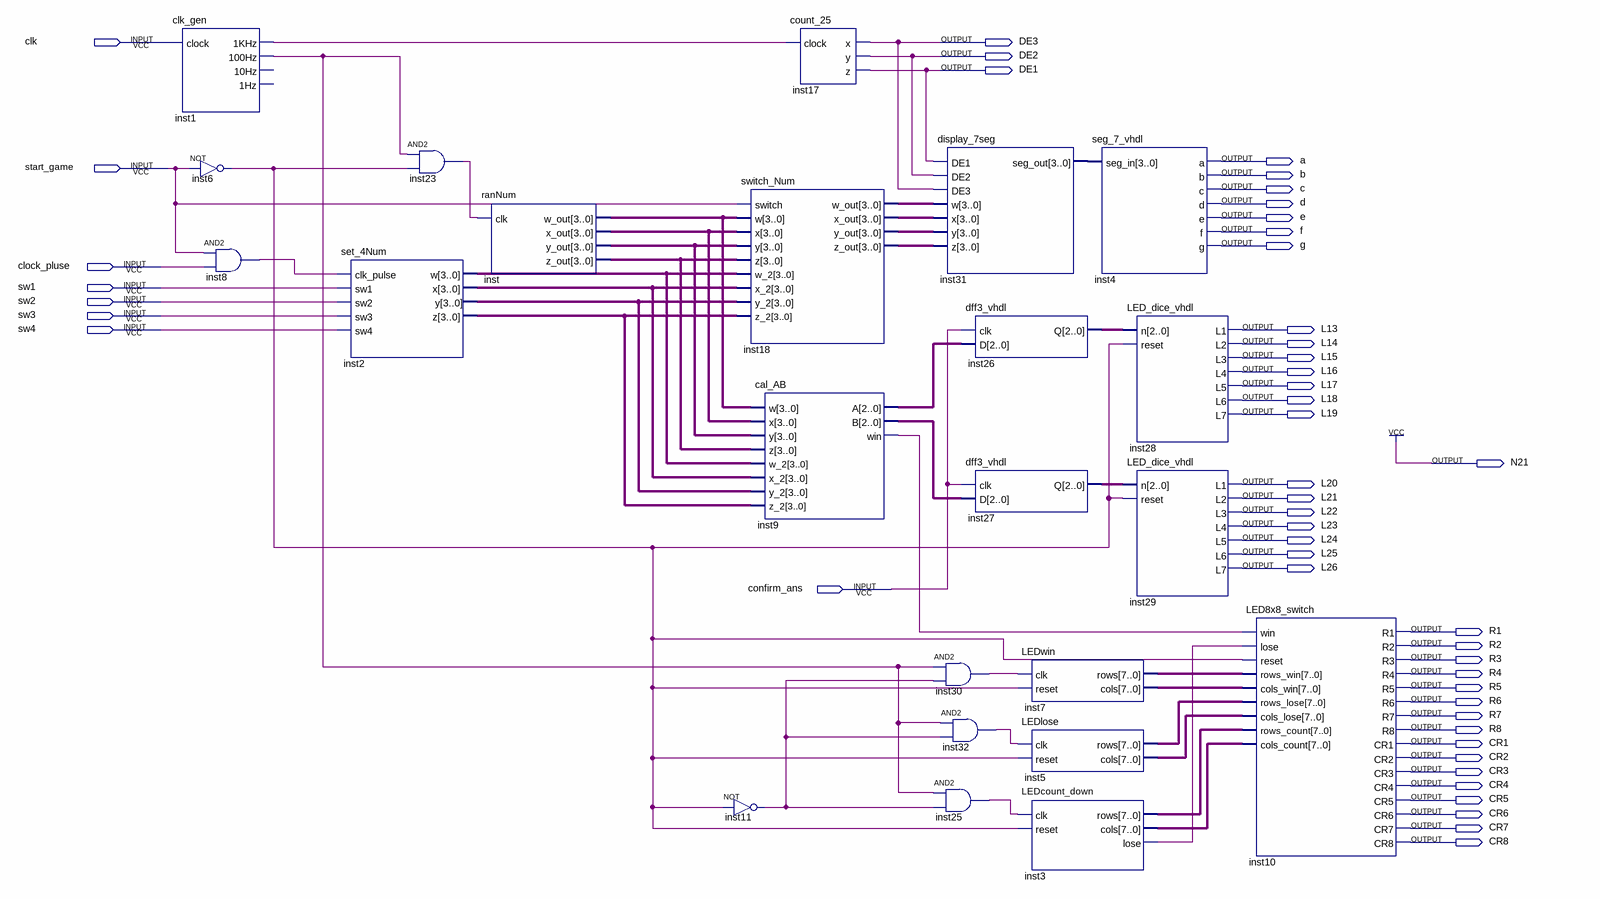
[diagram p0: schematic sheet]
// Quartus schematic Project_ver2.bdf as structural Verilog: 23 symbols, 49 pins
module Project_ver2 (
  input  clk,
  input  start_game,
  input  clock_pluse,
  input  sw1,
  input  sw2,
  input  sw3,
  input  sw4,
  input  confirm_ans,
  output DE3,
  output DE2,
  output DE1,
  output a,
  output b,
  output c,
  output d,
  output e,
  output f,
  output g,
  output L13,
  output L14,
  output L15,
  output L16,
  output L17,
  output L18,
  output L19,
  output N21,
  output L20,
  output L21,
  output L22,
  output L23,
  output L24,
  output L25,
  output L26,
  output R1,
  output R2,
  output R3,
  output R4,
  output R5,
  output R6,
  output R7,
  output R8,
  output CR1,
  output CR2,
  output CR3,
  output CR4,
  output CR5,
  output CR6,
  output CR7,
  output CR8
);

  wire inst1_1khz, inst1_100hz, inst3_lose, inst6_out, inst8_out, inst9_win, inst11_out, inst23_out,
       inst25_out, inst30_out, inst32_out;
  wire [2:0] inst9_a, inst9_b, inst26_q, inst27_q;
  wire [3:0] inst2_w, inst2_x, inst2_y, inst2_z, inst18_w_out, inst18_x_out, inst18_y_out, inst18_z_out,
       inst31_seg_out, inst_w_out, inst_x_out, inst_y_out, inst_z_out;
  wire [7:0] inst3_cols, inst3_rows, inst5_cols, inst5_rows, inst7_cols, inst7_rows;

  clk_gen inst1 (.clock(clk), .\1KHz (inst1_1khz), .\100Hz (inst1_100hz));  // open: 10Hz, 1Hz
  not inst6 (inst6_out, start_game);
  and inst8 (inst8_out, start_game, clock_pluse);
  set_4Num inst2 (
    .clk_pulse(inst8_out), .sw1(sw1), .sw2(sw2), .sw3(sw3), .sw4(sw4), .w(inst2_w), .x(inst2_x), .y(inst2_y),
    .z(inst2_z));
  and inst23 (inst23_out, inst1_100hz, inst6_out);
  ranNum inst (.clk(inst23_out), .w_out(inst_w_out), .x_out(inst_x_out), .y_out(inst_y_out), .z_out(inst_z_out));
  switch_Num inst18 (
    .switch(start_game), .w(inst_w_out), .x(inst_x_out), .y(inst_y_out), .z(inst_z_out), .w_2(inst2_w),
    .x_2(inst2_x), .y_2(inst2_y), .z_2(inst2_z), .w_out(inst18_w_out), .x_out(inst18_x_out),
    .y_out(inst18_y_out), .z_out(inst18_z_out));
  not inst11 (inst11_out, inst6_out);
  count_25 inst17 (.clock(inst1_1khz), .x(DE3), .y(DE2), .z(DE1));
  cal_AB inst9 (
    .w(inst_w_out), .x(inst_x_out), .y(inst_y_out), .z(inst_z_out), .w_2(inst2_w), .x_2(inst2_x),
    .y_2(inst2_y), .z_2(inst2_z), .A(inst9_a), .B(inst9_b), .win(inst9_win));
  display_7seg inst31 (
    .DE1(DE1), .DE2(DE2), .DE3(DE3), .w(inst18_w_out), .x(inst18_x_out), .y(inst18_y_out), .z(inst18_z_out),
    .seg_out(inst31_seg_out));
  dff3_vhdl inst26 (.clk(confirm_ans), .D(inst9_a), .Q(inst26_q));
  dff3_vhdl inst27 (.clk(confirm_ans), .D(inst9_b), .Q(inst27_q));
  and inst30 (inst30_out, inst1_100hz, inst11_out);
  and inst32 (inst32_out, inst1_100hz, inst11_out);
  and inst25 (inst25_out, inst1_100hz, inst11_out);
  LEDwin inst7 (.clk(inst30_out), .reset(inst6_out), .rows(inst7_rows), .cols(inst7_cols));
  LEDlose inst5 (.clk(inst32_out), .reset(inst6_out), .rows(inst5_rows), .cols(inst5_cols));
  LEDcount_down inst3 (.clk(inst25_out), .reset(inst6_out), .rows(inst3_rows), .cols(inst3_cols), .lose(inst3_lose));
  seg_7_vhdl inst4 (.seg_in(inst31_seg_out), .a(a), .b(b), .c(c), .d(d), .e(e), .f(f), .g(g));
  LED_dice_vhdl inst28 (
    .n(inst26_q), .reset(inst6_out), .L1(L13), .L2(L14), .L3(L15), .L4(L16), .L5(L17), .L6(L18), .L7(L19));
  LED_dice_vhdl inst29 (
    .n(inst27_q), .reset(inst6_out), .L1(L20), .L2(L21), .L3(L22), .L4(L23), .L5(L24), .L6(L25), .L7(L26));
  LED8x8_switch inst10 (
    .win(inst9_win), .lose(inst3_lose), .reset(inst6_out), .rows_win(inst7_rows), .cols_win(inst7_cols),
    .rows_lose(inst5_rows), .cols_lose(inst5_cols), .rows_count(inst3_rows), .cols_count(inst3_cols),
    .R1(R1), .R2(R2), .R3(R3), .R4(R4), .R5(R5), .R6(R6), .R7(R7), .R8(R8), .CR1(CR1), .CR2(CR2), .CR3(CR3),
    .CR4(CR4), .CR5(CR5), .CR6(CR6), .CR7(CR7), .CR8(CR8));

  assign N21 = 1'b1;
endmodule
